# EAGLE design 8-smd-dip (EAGLE 6.1)
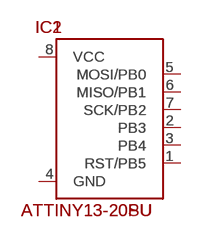
[diagram p0: schematic, sheet 1]

## Parts
IC1  ATTINY13-20PU  [DIL08]
IC2  ATTINY13-20SU  [SOIC8]

## Nets
N$1: IC1.8(VCC) IC2.8(VCC)
N$2: IC1.4(GND) IC2.4(GND)
N$3: IC1.5(MOSI/PB0) IC2.5(MOSI/PB0)
N$4: IC1.6(MISO/PB1) IC2.6(MISO/PB1)
N$5: IC1.7(SCK/PB2) IC2.7(SCK/PB2)
N$6: IC1.2(PB3) IC2.2(PB3)
N$7: IC1.3(PB4) IC2.3(PB4)
N$8: IC1.1(RST/PB5) IC2.1(RST/PB5)

## Library data of the parts
IC1 IC2 = attiny13:ATTINY13-20*

## Board
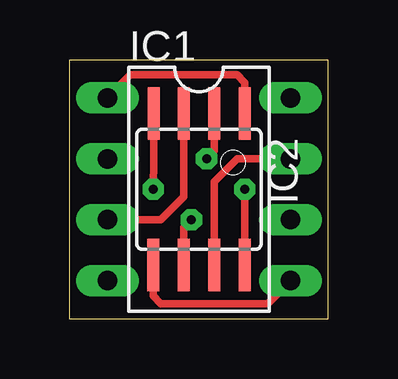
[diagram p1: board, top side]
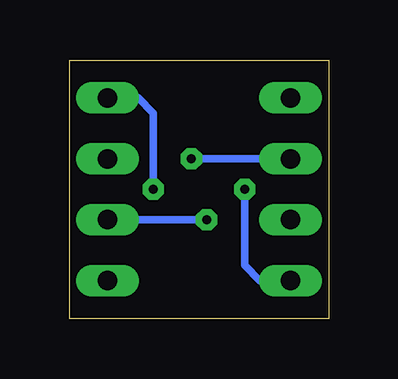
[diagram p2: board, bottom side, seen from below]

Size 10.78 x 10.78 mm. Coordinates in mm from the lower left corner, seen from the top.
Outline: 0,0 10.78,0 10.78,10.78 0,10.78 0,0
Copper layers (1*16): Top 0.035mm / dielectric 1.5mm / Bottom 0.035mm
Design rules: minimum track width 10mil, minimum drill 24mil, track to track 12mil, track to pad 12mil, pad to pad 12mil, via to via 12mil, smd to smd 10mil, copper to edge 12mil, drill to drill 12mil, minimum pad ring 10mil, minimum via ring 10mil, stop-mask expansion 4mil, vias tented up to drill 0mil, thermal gap 12mil

### Footprints (pad centres in the part's own frame; a part is rotated, then mirrored left to right if it is on the bottom)
DIL08 = drill 0.813 long: 1 -3.81,-3.81; 2 -1.27,-3.81; 3 1.27,-3.81; 4 3.81,-3.81; 5 3.81,3.81; 6 1.27,3.81; 7 -1.27,3.81; 8 -3.81,3.81
SOIC8 = smd 0.5 x 2.2: 1 -1.905,-3.154; 2 -0.645,-3.154; 3 0.625,-3.154; 4 1.895,-3.154; 5 1.905,3.154; 6 0.635,3.154; 7 -0.635,3.154; 8 -1.905,3.154

### Placement (x,y rotation side)
IC1  5.4,5.4 270 top
IC2  5.4,5.4 180 top

### Tracks (layer width: path | path; a pad name or v marks a point on that pad's centre or on a via)
N$1  (via drill 0.38)
  Top 0.305: IC2.8 v7.3,5.4
  Bottom 0.305: v7.3,5.4 7.3,8.57 7.94,9.21 IC1.8
N$2  (via drill 0.38)
  Top 0.305: IC2.4 3.5,6.68 v3.49,5.4
  Bottom 0.305: v3.49,5.4 3.49,2.22 2.86,1.59 IC1.4
N$3
  Top 0.305: IC2.5 3.49,0.95 3.81,0.64 8.26,0.64 IC1.5
N$4  (via drill 0.38)
  Top 0.305: IC2.6 4.76,3.81 v5.08,4.13
  Bottom 0.305: v5.08,4.13 IC1.6
N$5
  Top 0.305: IC2.7 6.03,5.71 6.99,6.67 IC1.7
N$6  (via drill 0.38)
  Top 0.305: IC2.2 6.04,7 v5.71,6.67
  Bottom 0.305: v5.71,6.67 IC1.2
N$7
  Top 0.305: IC2.3 4.77,5.09 3.81,4.13 IC1.3
N$8
  Top 0.305: IC2.1 7.3,9.84 6.99,10.16 2.54,10.16 IC1.1